# EAGLE design aphenol-breakout (EAGLE 7.2.0)
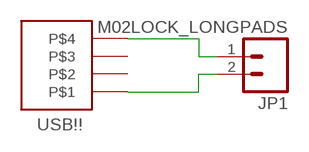
[diagram p0: schematic, sheet 1]

## Parts
JP1  M02LOCK_LONGPADS  [1X02_LOCK_LONGPADS]
U$1  AMPHENOL_USB-A_RUGGED_SINGLE  [AMPHENOL_USB-A_RUGGED_SINGLE]

## Nets
N$1: JP1.2 U$1.P$1
N$2: JP1.1 U$1.P$4
Unconnected: U$1.P$2 U$1.P$3

## Library data of the parts
JP1 = SparkFun-Connectors:M02: Standard 2-pin 0.1" header. Use with - straight break away headers ( PRT-00116) - right angle break away headers (PRT-00553) - swiss pins (PRT-00743) - machine pins (PRT-00117) - female headers (PRT-00115) Molex polarized connector foot print use with: PRT-08233 with associated crimp pins and housings. 2.54_SCREWTERM for use with PRT-10571. 3.5mm Screw Terminal footprints for PRT-08084 5mm Screw Terminal footprints for use with PRT-08433
U$1 = myRandomThings:AMPHENOL_USB-A_RUGGED_SINGLE

## Board
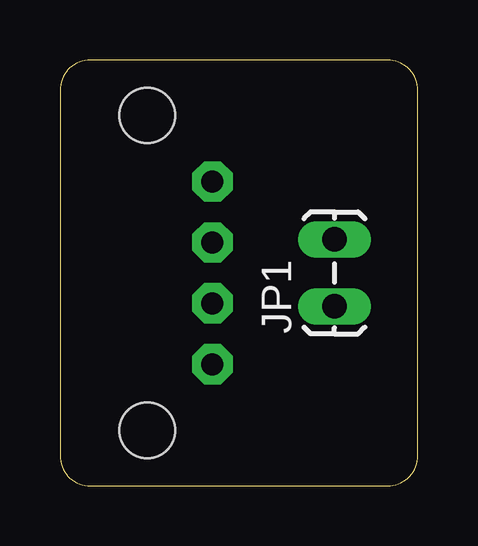
[diagram p1: board, top side]
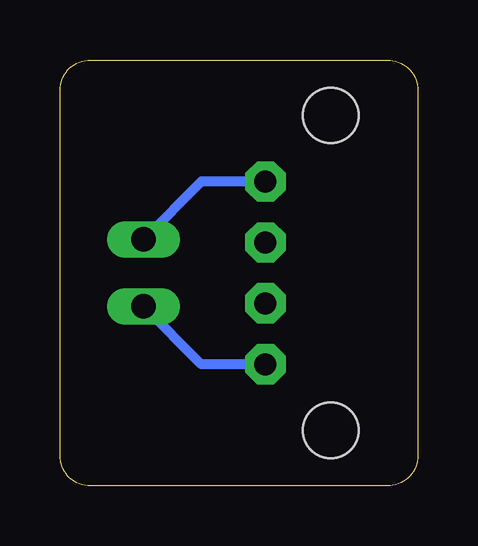
[diagram p2: board, bottom side, seen from below]

Size 14.91 x 17.77 mm. Coordinates in mm from the lower left corner, seen from the top.
Outline: 0,16.5 0,1.27 arc90 1.27,0 13.64,0 arc90 14.91,1.27 14.91,16.5 arc90 13.64,17.77 1.27,17.77 arc90 0,16.5
Copper layers (1*16): Top 0.035mm / dielectric 1.5mm / Bottom 0.035mm
Design rules "default": minimum track width 10mil, minimum drill 24mil, track to track 8mil, track to pad 8mil, pad to pad 8mil, via to via 8mil, smd to smd 8mil, copper to edge 40mil, drill to drill 8mil, minimum pad ring 10mil, minimum via ring 8mil, stop-mask expansion 4mil, vias tented up to drill 0mil, thermal gap 10mil

### Footprints (pad centres in the part's own frame; a part is rotated, then mirrored left to right if it is on the bottom)
1X02_LOCK_LONGPADS = drill 1.016 long: 1 -0.127,0; 2 2.667,0
AMPHENOL_USB-A_RUGGED_SINGLE = drill 0.914 pad 1.676 octagon: P$1 -3.81,0; P$2 -1.27,0; P$3 1.27,0; P$4 3.81,0 | hole 2.311: 6.566,-2.718; -6.566,-2.718

### Placement (x,y rotation side)
JP1  11.43,7.62 90 top
U$1  6.35,8.89 270 top

### Tracks (layer width: path | path; a pad name or v marks a point on that pad's centre or on a via)
N$1
  Bottom 0.406: U$1.P$1 9.02,12.7 JP1.2
N$2
  Bottom 0.406: U$1.P$4 9.02,5.08 JP1.1